# Altium schematic sheet Sensor_Glove_Power-X01.SchDoc: SENSOR GLOVE POWER (part 1 of 3)
size Letter; Author: C. DEMOLDER; Engineer: C. DEMOLDER; Organization: GEORGIA TECH; Address1: NORTH AVE NW; Address2: ATLANTA, GA, 30332; DocumentNumber: P001; Revision: X01; SheetNumber: 3; SheetTotal: 4
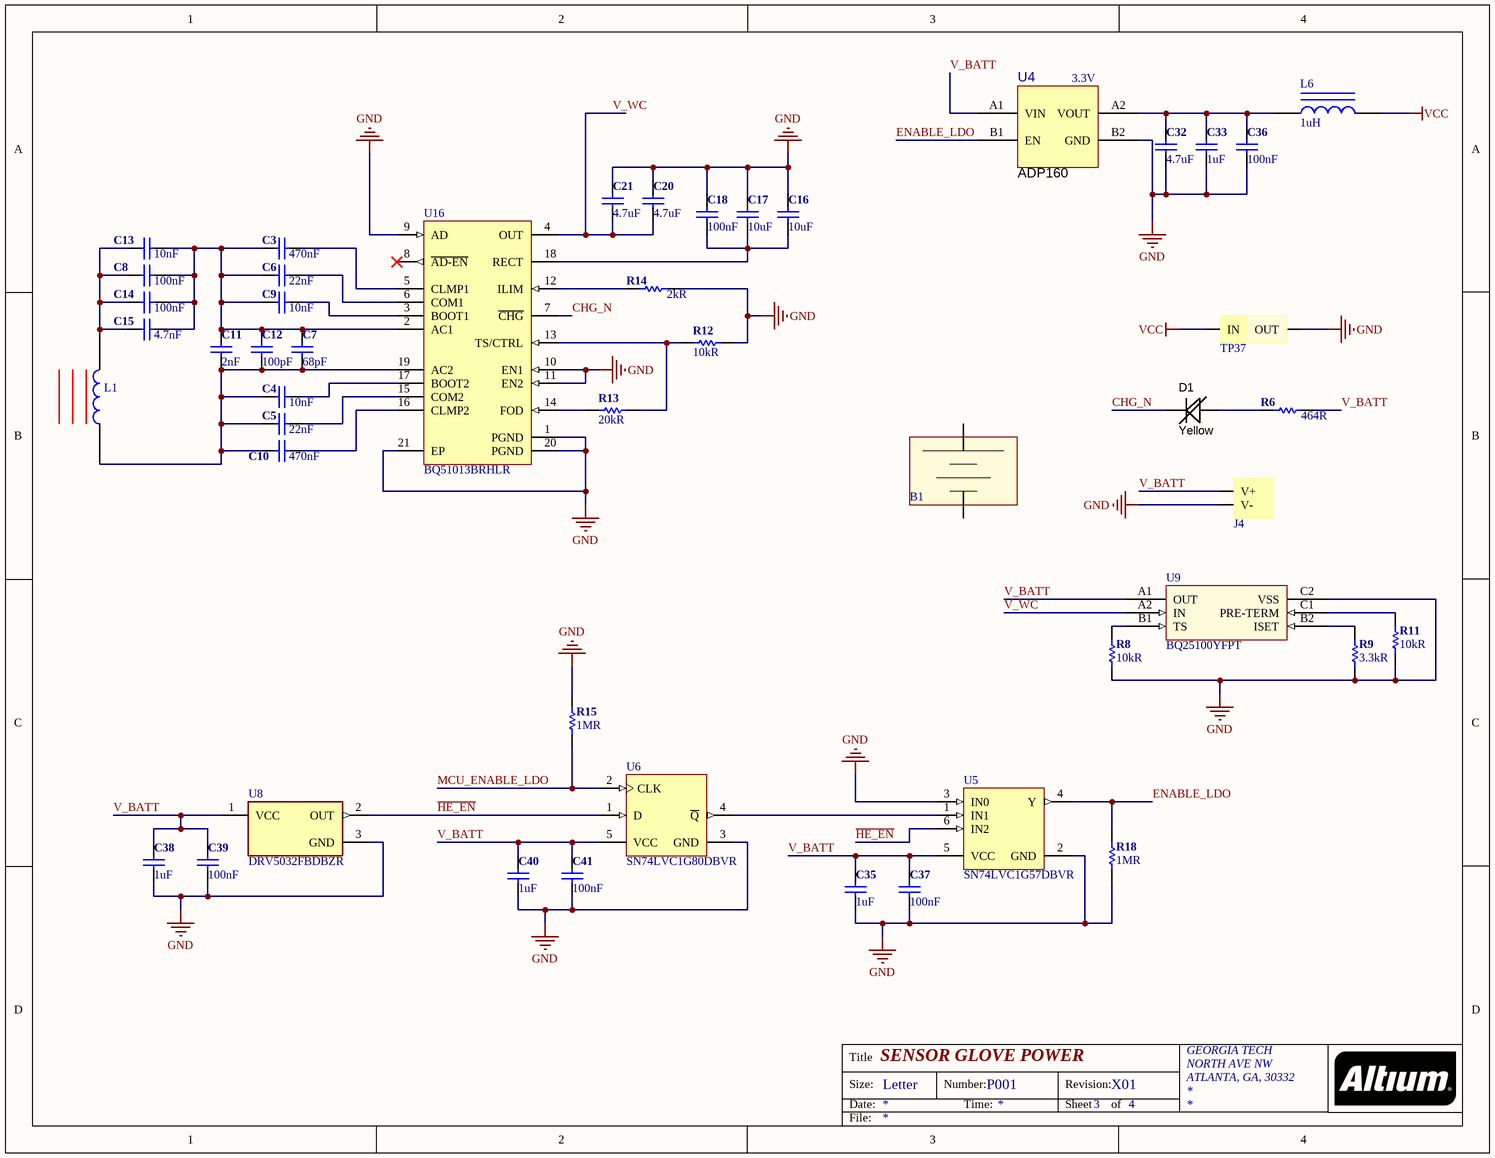
[diagram p0: Sensor_Glove_Power-X01.SchDoc]

## Parts
B1  40 mAh BATTERY  [BATTERY]  (value not drawn)
C3  470nF  [C0402]
C4  10nF  [C0402]
C5  22nF  [C0402]
C6  22nF  [C0402]
C7  68pF  [C0402]
C8  100nF  [C0402]
C9  10nF  [C0402]
C10  470nF  [C0402]
C11  2nF  [C0402]
C12  100pF  [C0402]
C13  10nF  [C0402]
C14  100nF  [C0402]
C15  4.7nF  [C0402]
C16  10uF  [C0603]
C17  10uF  [C0603]
C18  100nF  [C0603]
C20  4.7uF  [C0402]
C21  4.7uF  [C0402]
C32  4.7uF  [C0402]
C33  1uF  [C0402]
C35  1uF  [C0402]
C36  100nF  [C0402]
C37  100nF  [C0402]
C38  1uF  [C0402]
C39  100nF  [C0402]
C40  1uF  [C0402]
C41  100nF  [C0402]
D1  Yellow  [LED_0402]
J4  JUMPER WITH 40 mAh BATTERY  [JUMPER_BATTERY]  (value not drawn)
L1  WIRELESS CHARGING COIL, RECEIVER  [760308101219]  (value not drawn)
L6  1uH  [L0402]
R6  464R  [R0402]
R8  10kR  [R0402]
R9  3.3kR  [R0402]
R11  10kR  [R0402]
R12  10kR  [R0402]
R13  20kR  [R0402]
R14  2kR  [R0402]
R15  1MR  [R0402]
R18  1MR  [R0402]
TP37  JUMPER  [JUMPER]  (value not drawn)
U4  ADP160  Output Voltage: 3.3V  [ADP160]
U5  SN74LVC1G57DBVR  [DBV0006A_M]
U6  SN74LVC1G80DBVR  [DBV0005A_N]
U8  DRV5032FBDBZR  [FP-DBZ0003A-MFG]
U9  BQ25100YFPT  [YZP0006]
U16  BQ51013BRHLR  [BQ51013BRHLR]

## Nets
GND: C16.2 C17.2 C18.2 C20.1 C21.1 C32.2 C33.2 C35.2 C36.1 C37.1 C38.2 C39.1 C40.2 C41.1 J4.2(V-) R8.1 R9.1 R11.1 R12.2 R14.2 R15.1 R18.2 TP37.2(OUT) U4.B2(GND) U5.2(GND) U5.3(IN0) U6.3(GND) U8.3(GND) U9.C2(VSS) U16.1(PGND) U16.9(AD) U16.10(EN1) U16.11(EN2) U16.20(PGND) U16.21(EP)
VCC: L6.2 TP37.1(IN)
~{HE_EN}: U5.6(IN2) U6.1(D) U8.2(OUT)
CHG_N: D1.K U16.7(~{CHG})
ENABLE_LDO: R18.1 U4.B1(EN) U5.4(Y)
MCU_ENABLE_LDO: R15.2 U6.2(CLK)
V_BATT: C35.1 C37.2 C38.1 C39.2 C40.1 C41.2 J4.1(V+) R6.2 U4.A1(VIN) U5.5(VCC) U6.5(VCC) U8.1(VCC) U9.A1(OUT)
V_WC: C20.2 C21.2 U9.A2(IN) U16.4(OUT)
NetC3_1: C3.1 C6.1 C7.1 C8.2 C9.1 C11.1 C12.1 C13.2 C14.2 C15.2 U16.2(AC1)
NetC3_2: C3.2 U16.5(CLMP1)
NetC4_1: C4.1 C5.1 C7.2 C10.1 C11.2 C12.2 L1.1 U16.19(AC2)
NetC4_2: C4.2 U16.17(BOOT2)
NetC5_2: C5.2 U16.15(COM2)
NetC6_2: C6.2 U16.6(COM1)
NetC8_1: C8.1 C13.1 C14.1 C15.1 L1.2
NetC9_2: C9.2 U16.3(BOOT1)
NetC10_2: C10.2 U16.16(CLMP2)
NetC16_1: C16.1 C17.1 C18.1 U16.18(RECT)
NetC32_1: C32.1 C33.1 C36.2 L6.1 U4.A2(VOUT)
NetD1_A: D1.A R6.1
NetR8_2: R8.2 U9.B1(TS)
NetR9_2: R9.2 U9.B2(ISET)
NetR11_2: R11.2 U9.C1(PRE-TERM)
NetR12_1: R12.1 R13.2 U16.13(TS/CTRL)
NetR13_1: R13.1 U16.14(FOD)
NetR14_1: R14.1 U16.12(ILIM)
NetU5_1: U5.1(IN1) U6.4(~{Q})

Not connected (* = marked no-connect by the designer): U16 8(~{AD-EN})*

## Notes on the sheet
- Title
- Size:
- Date:
- Letter
- Number:
- Time:
- Revision:
- Sheet
- of
- File: